# EAGLE design 717_ConvertionBoard_TypeF_Rev010000 (EAGLE 9.6.2)
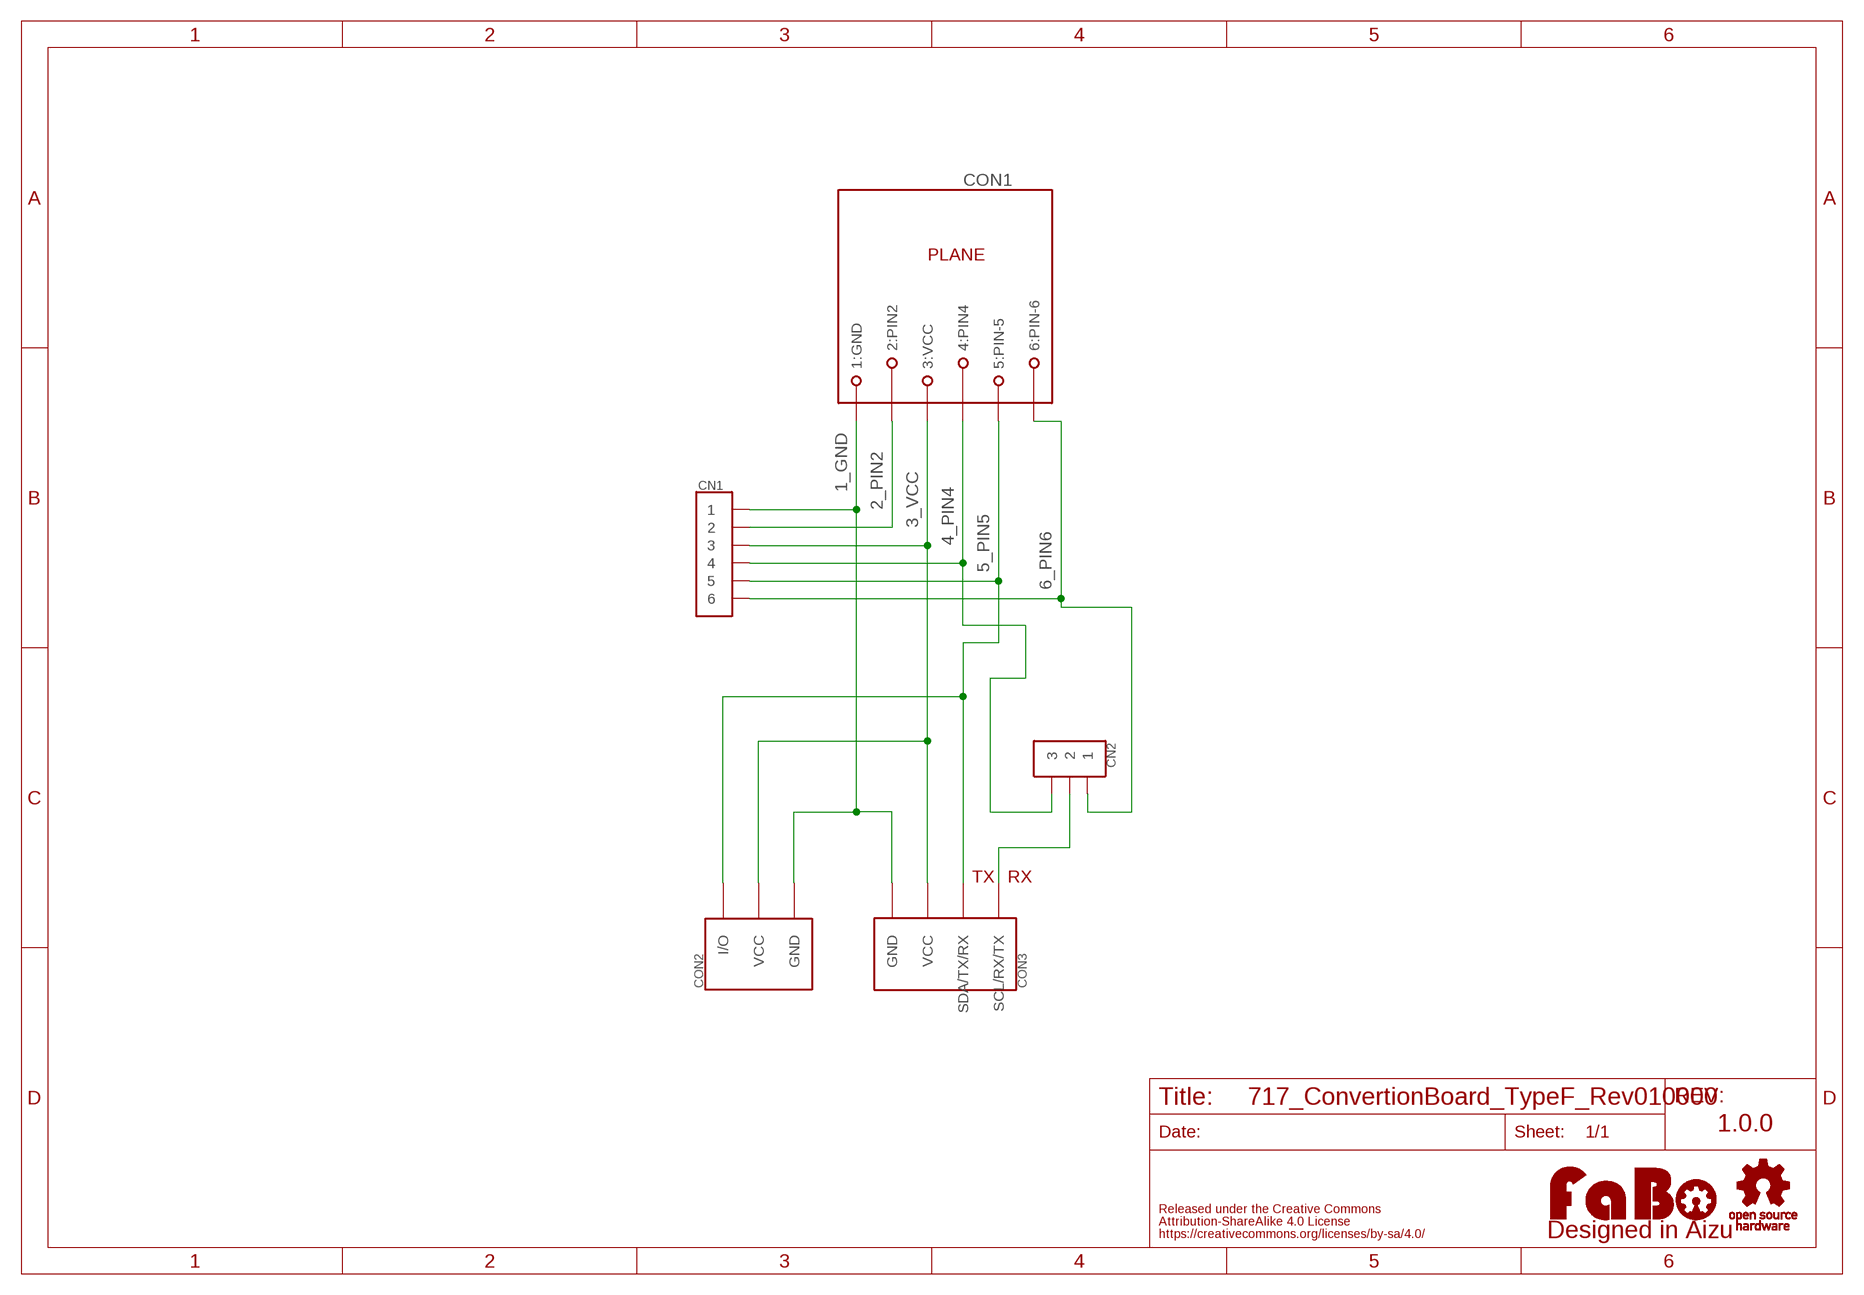
[diagram p0: schematic, sheet 1]

## Parts
CN1  PIN_1X6  [PIN_1X6]
CN2  PIN_1X3  [PIN_1X3]
CON1  MODULAR-JACK-6P-PLANE  [7002-6PXC-X]
CON2  FABO_BRICK_3PIN-S03B-PASK-2  [FABO_BRICK_3PIN_S03B-PASK-2]
CON3  FABO_BRICK_4PIN  [FABO_BRICK_PLANE_S04B-PASK-2]
LOGO1  LOGO_FABO-M  [LOGO_FABO_M]
U$2  LOGO_OSHW-M_BOTTOM  [LOGO_OSHW_M_BOTTOM]

## Nets
1_GND: CN1.1 CON1.1(1:GND) CON2.GND CON3.GND
2_PIN2: CN1.2 CON1.2(2:PIN2)
3_VCC: CN1.3 CON1.3(3:VCC) CON2.VCC CON3.VCC
4_PIN4: CN1.4 CN2.3 CON1.4(4:PIN4)
5_PIN5: CN1.5 CON1.5(5:PIN-5) CON2.I/O CON3.3(SDA/TX/RX)
6_PIN6: CN1.6 CN2.1 CON1.6(6:PIN-6)
RX: CN2.2 CON3.4(SCL/RX/TX)

## Notes on the sheet
- TX | RX
- 1.0.0

## Library data of the parts
CN1 = FaBo-PIN:PIN_1X6
CN2 = FaBo-PIN:PIN_1X3
CON1 = FaBo-Connetor:MODULAR-JACK-6P-PLANE
CON2 = FaBo-Template:FABO_BRICK_3PIN: FaBo Brick 3pin
CON3 = FaBo-Template:FABO_BRICK_4PIN
LOGO1 = component:LOGO_FABO
U$2 = FaBo-etc:LOGO_OSHW

## Board
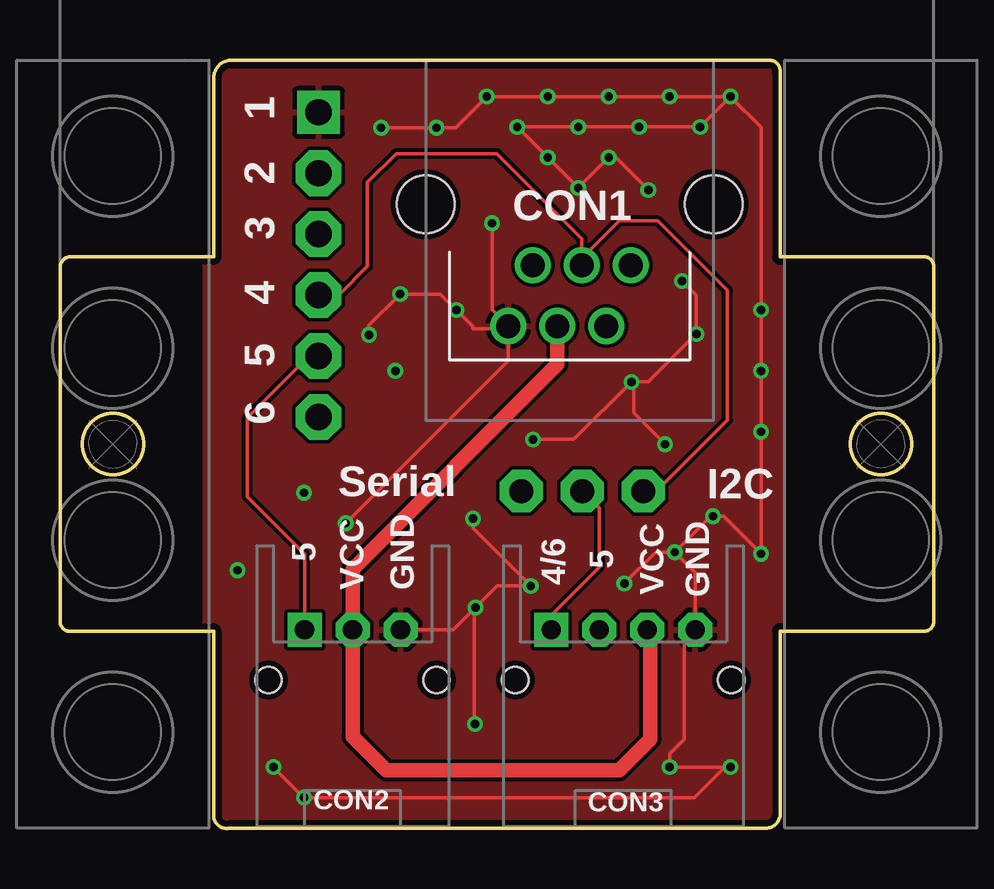
[diagram p1: board, top side]
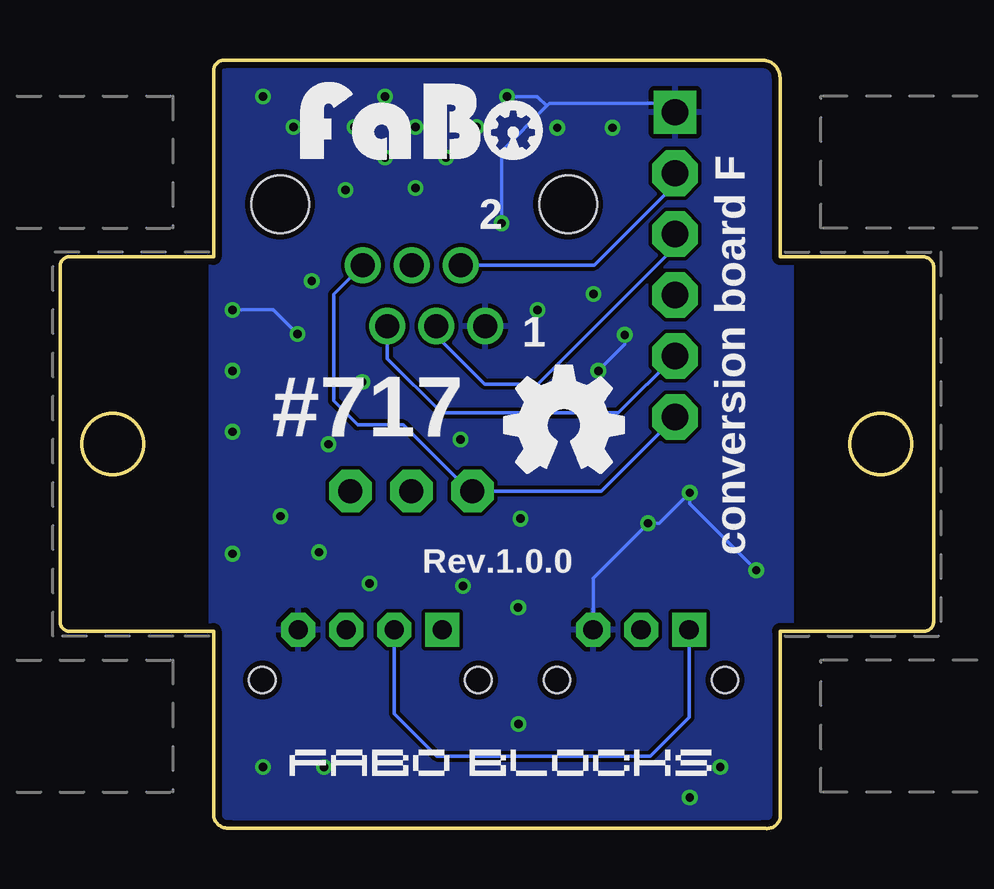
[diagram p2: board, bottom side, seen from below]

Size 36.4 x 32.02 mm. Coordinates in mm from the lower left corner, seen from the top.
Outline: 29.3,0.02 7.1,0.02 arc-90 6.4,0.42 6.4,8.22 0.4,8.22 arc-90 0,8.62 0,23.32 arc-90 0.4,23.82 6.4,23.82 6.4,31.22 arc-90 7.1,32.02 29.5,32.02 arc-99 30,31.52 30,23.82 36,23.82 arc-90 36.4,23.42 36.4,8.62 arc-90 36,8.22 30,8.22 30,0.52 arc-90 29.3,0.02
Outline: circle at 34.2,16.02 radius 1.27
Outline: circle at 2.2,16.02 radius 1.27
Copper layers (1*16): Top 0.035mm / dielectric 1.6mm / Bottom 0.035mm
Design rules "PCBway": minimum track width 6mil, minimum drill 12mil, track to track 6mil, track to pad 6mil, pad to pad 6mil, via to via 6mil, smd to smd 6mil, copper to edge 10mil, drill to drill 10mil, minimum pad ring 10mil, minimum via ring 6mil, stop-mask expansion 2mil, vias tented up to drill 100mil, thermal gap 8mil

### Footprints (pad centres in the part's own frame; a part is rotated, then mirrored left to right if it is on the bottom)
PIN_1X6 = drill 1.1 pad 1.778 square: 1 -6.35,0 | drill 1.1 pad 1.9 octagon: 2 -3.81,0; 3 -1.27,0; 4 1.27,0; 5 3.81,0; 6 6.35,0
PIN_1X3 = drill 1 pad 1.778 octagon: 1 -2.54,0; 2 0,0; 3 2.54,0
7002-6PXC-X = drill 1: 1 2.55,5.08; 2 1.53,2.54; 3 0.51,5.08; 4 -0.51,2.54; 5 -1.53,5.08; 6 -2.55,2.54 | hole 2.4: -6,0; 6,0
FABO_BRICK_3PIN_S03B-PASK-2 = drill 0.8 pad 1.422 octagon: GND -2,0; VCC 0,0 | drill 0.8 pad 1.422 square: I/O 2,0 | hole 1.1: 3.5,2.1; -3.5,2.1
FABO_BRICK_PLANE_S04B-PASK-2 = drill 0.8 pad 1.422 octagon: 3 1,0; GND -3,0; VCC -1,0 | drill 0.8 pad 1.422 square: 4 3,0 | hole 1.1: 4.5,2.1; -4.5,2.1

### Placement (x,y rotation side)
CN1  10.77,23.49 270 top
CN2  21.76,14.06 0 top
CON1  21.23,26.01 180 top
CON2  12.19,8.29 180 top
CON3  23.47,8.29 180 top
LOGO1  21.33,27.48 0 bottom
U$2  15.39,16.81 0 top
U$3  [4-1BLOCK]  2.2,16.02 0 top
U$4  [4-1BLOCK]  34.2,16.02 180 top

### Tracks (layer width: path | path; a pad name or v marks a point on that pad's centre or on a via)
1_GND  (via drill 0.35)
  Top 0.152: v18,25.22 18,21.61 18.65,20.97 | 18.65,20.97 CON1.1 18.68,19.5 v11.9,12.72 | v13.38,29.2 v15.68,29.2 16.48,29.2 v17.78,30.5 v20.32,30.5 v22.86,30.5 v25.4,30.5 v27.94,30.5 v27.93,30.49 | v27.93,30.49 v26.67,29.23 v24.13,29.23 v21.59,29.23 v19.05,29.23 v20.32,27.96 v21.59,26.69 v22.86,27.96 23.16,27.96 v24.51,26.61 | v25.91,22.81 26.51,22.21 v26.51,20.61 24.51,18.61 23.9,18.61 | 23.9,18.61 v23.81,18.61 21.41,16.21 v19.71,16.21 | v25.21,16.01 23.9,17.32 23.9,18.61 | v17.21,12.91 17.21,12.51 v19.61,10.11 18.21,10.11 v17.31,9.21 17.26,9.16 | 17.26,9.16 16.39,8.29 CON2.GND | v17.29,4.36 17.26,4.39 17.26,9.16 | 27.7,2.56 v25.4,2.56 25.4,3.12 26,3.72 26,7.82 CON3.GND 26.47,10.65 v25.61,11.51 | 27.7,2.56 v27.94,2.56 | v25.61,11.51 27.11,13.01 v27.21,13.01 27.65,13.01 v29.21,11.45 v29.21,16.53 v29.21,19.07 v29.21,21.61 29.21,29.21 v27.93,30.49 | v23.51,10.21 24.81,11.51 v25.61,11.51 | v12.87,20.57 12.87,20.97 v14.17,22.27 15.85,22.27 v16.51,21.61 17.2,20.92 17.2,20.82 18.5,20.82 18.65,20.97 | v8.89,2.56 v10.16,1.29 26.43,1.29 27.7,2.56
  Bottom 0.152: CN1.1 11.15,30.22 16,30.22 16.12,30.11 | 16.12,30.11 18,28.22 v18,25.22 | CON2.GND 14.19,10.43 v11.9,12.72 11.43,12.72 v10.16,13.99 10.16,13.53 v7.39,10.76 | 16.12,30.11 16.51,30.5 v17.78,30.5 | v26.51,20.61 27.51,21.61 v29.21,21.61 | v13.97,19.07 12.87,20.17 v12.87,20.57
  pour Bottom (isolate 0.152, rank 6): 5.9,0.02 30.14,0.02 30.14,33.09 5.9,33.09
  pour Top (isolate 0.152): 6,0.02 30.14,0.02 30.14,32.69 6,32.69
2_PIN2
  Bottom 0.152: CON1.2 14.15,23.47 10.77,26.85 CN1.2
3_VCC
  Top 0.61: CON3.VCC 24.6,8.16 24.6,3.72 23.3,2.42 13.6,2.42 12.19,3.83 CON2.VCC 12.19,10.81 20.72,19.34 CON1.3
  Bottom 0.152: CN1.3 10.77,24.25 16.5,18.52 18.7,18.52 20.72,20.54 CON1.3
4_PIN4
  Top 0.152: CN2.3 24.84,14.06 27.8,17.02 27.8,22.42 24.9,25.32 23.3,25.32 21.74,23.76 | 21.74,23.76 CON1.4 | 21.74,23.76 21.74,24.58 18.2,28.12 14,28.12 12.8,26.92 12.8,23.42 11.61,22.22 CN1.4
5_PIN5
  Top 0.152: CON2.I/O 10.19,11.43 7.8,13.82 7.8,17.12 10.37,19.68 CN1.5
  Bottom 0.152: CON1.5 22.76,19.58 20.5,17.32 13.14,17.32 CN1.5 | CON3.3 22.47,4.79 20.7,3.02 11.8,3.02 10.19,4.63 CON2.I/O
6_PIN6
  Bottom 0.152: CN1.6 13.86,14.06 CN2.1 19.34,14.06 22.1,16.82 24,16.82 25,17.82 25,22.25 CON1.6
RX
  Top 0.152: CN2.2 22.46,13.36 22.46,10.88 20.47,8.89 CON3.4

### Text on the board
tPlace: 1 | 2 | 3 | CON1 | 4 | 5 | 6 | Serial | I2C | 5 | GND | VCC | 4/6 | 5 | VCC | GND
bPlace: 2 | 1 | conversion board F | #717 | Rev.1.0.0
Document: 717 conversion board Rev1.0.0 / 2023/01/23
tDocu: PS1740P02E